# Altium schematic sheet Schematic_ChessBot V1.schdoc
size 296 x 195 mm
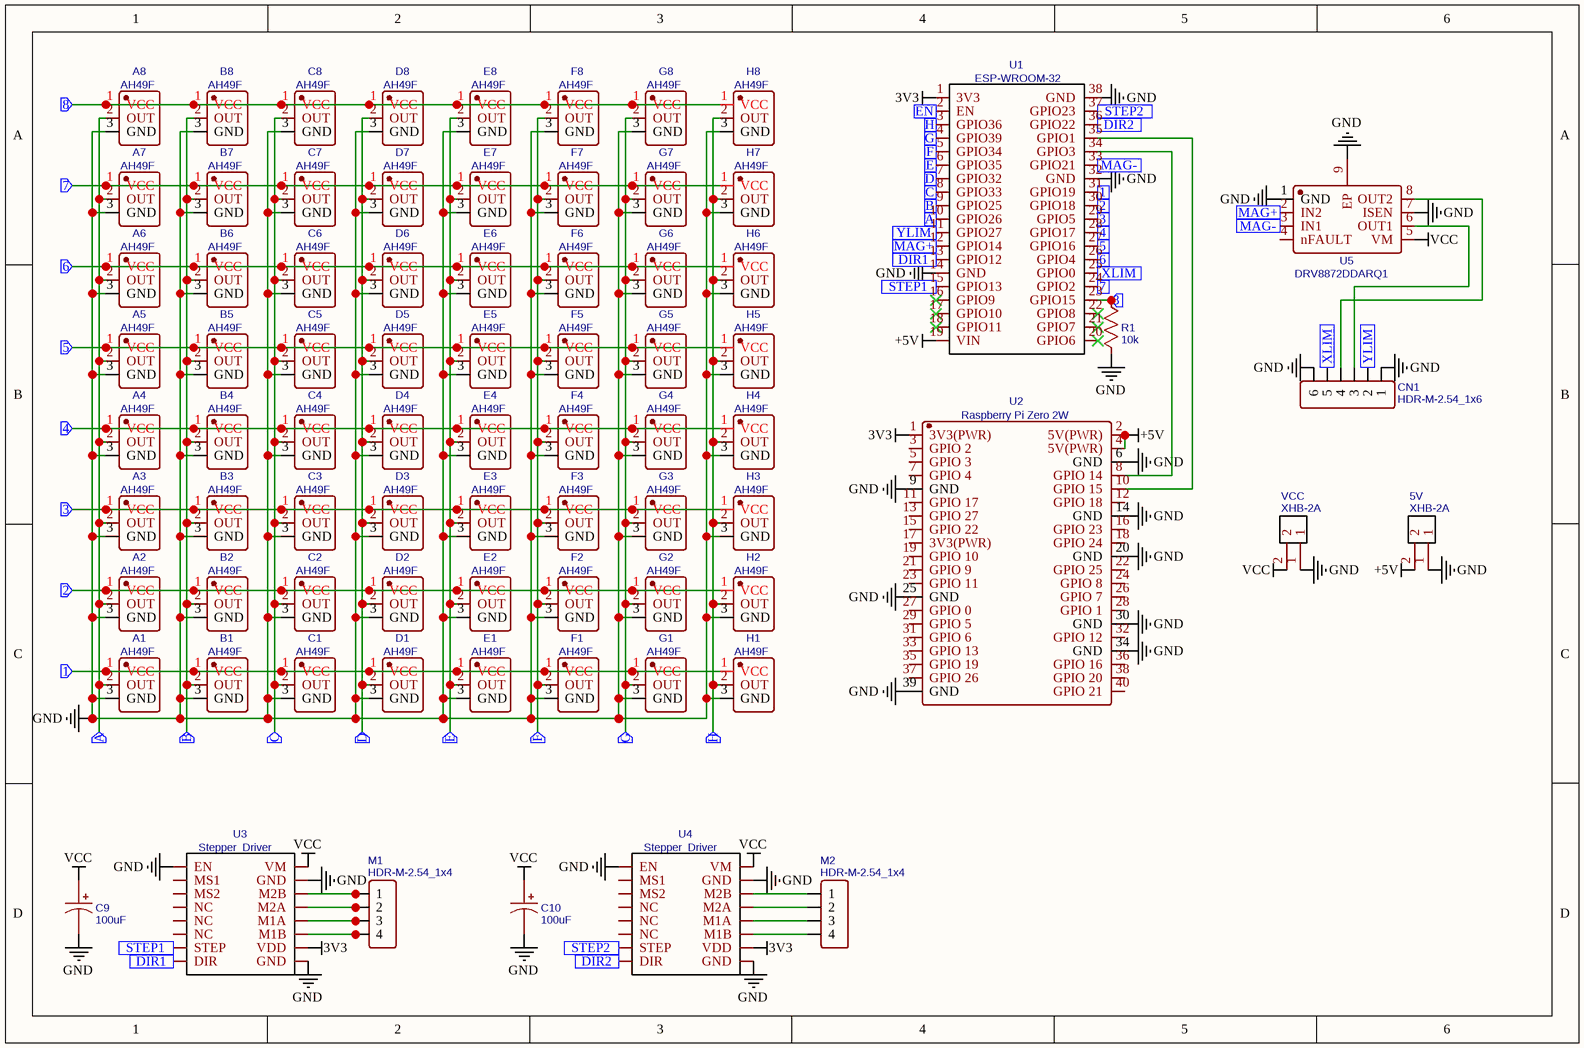
[diagram p0: Schematic_ChessBot V1.schdoc]

## Parts
5V  XHB-2A  [CONN-TH_XHB-2A]
A1  AH49F  [SC-59-3_L2.9-W1.6-P0.95-LS2.9-BR]
A2  AH49F  [SC-59-3_L2.9-W1.6-P0.95-LS2.9-BR]
A3  AH49F  [SC-59-3_L2.9-W1.6-P0.95-LS2.9-BR]
A4  AH49F  [SC-59-3_L2.9-W1.6-P0.95-LS2.9-BR]
A5  AH49F  [SC-59-3_L2.9-W1.6-P0.95-LS2.9-BR]
A6  AH49F  [SC-59-3_L2.9-W1.6-P0.95-LS2.9-BR]
A7  AH49F  [SC-59-3_L2.9-W1.6-P0.95-LS2.9-BR]
A8  AH49F  [SC-59-3_L2.9-W1.6-P0.95-LS2.9-BR]
B1  AH49F  [SC-59-3_L2.9-W1.6-P0.95-LS2.9-BR]
B2  AH49F  [SC-59-3_L2.9-W1.6-P0.95-LS2.9-BR]
B3  AH49F  [SC-59-3_L2.9-W1.6-P0.95-LS2.9-BR]
B4  AH49F  [SC-59-3_L2.9-W1.6-P0.95-LS2.9-BR]
B5  AH49F  [SC-59-3_L2.9-W1.6-P0.95-LS2.9-BR]
B6  AH49F  [SC-59-3_L2.9-W1.6-P0.95-LS2.9-BR]
B7  AH49F  [SC-59-3_L2.9-W1.6-P0.95-LS2.9-BR]
B8  AH49F  [SC-59-3_L2.9-W1.6-P0.95-LS2.9-BR]
C1  AH49F  [SC-59-3_L2.9-W1.6-P0.95-LS2.9-BR]
C2  AH49F  [SC-59-3_L2.9-W1.6-P0.95-LS2.9-BR]
C3  AH49F  [SC-59-3_L2.9-W1.6-P0.95-LS2.9-BR]
C4  AH49F  [SC-59-3_L2.9-W1.6-P0.95-LS2.9-BR]
C5  AH49F  [SC-59-3_L2.9-W1.6-P0.95-LS2.9-BR]
C6  AH49F  [SC-59-3_L2.9-W1.6-P0.95-LS2.9-BR]
C7  AH49F  [SC-59-3_L2.9-W1.6-P0.95-LS2.9-BR]
C8  AH49F  [SC-59-3_L2.9-W1.6-P0.95-LS2.9-BR]
C9  100uF  [8X12 CAP]
C10  100uF  [8X12 CAP]
CN1  HDR-M-2.54_1x6  [HDR-M-2.54_1X6]
D1  AH49F  [SC-59-3_L2.9-W1.6-P0.95-LS2.9-BR]
D2  AH49F  [SC-59-3_L2.9-W1.6-P0.95-LS2.9-BR]
D3  AH49F  [SC-59-3_L2.9-W1.6-P0.95-LS2.9-BR]
D4  AH49F  [SC-59-3_L2.9-W1.6-P0.95-LS2.9-BR]
D5  AH49F  [SC-59-3_L2.9-W1.6-P0.95-LS2.9-BR]
D6  AH49F  [SC-59-3_L2.9-W1.6-P0.95-LS2.9-BR]
D7  AH49F  [SC-59-3_L2.9-W1.6-P0.95-LS2.9-BR]
D8  AH49F  [SC-59-3_L2.9-W1.6-P0.95-LS2.9-BR]
E1  AH49F  [SC-59-3_L2.9-W1.6-P0.95-LS2.9-BR]
E2  AH49F  [SC-59-3_L2.9-W1.6-P0.95-LS2.9-BR]
E3  AH49F  [SC-59-3_L2.9-W1.6-P0.95-LS2.9-BR]
E4  AH49F  [SC-59-3_L2.9-W1.6-P0.95-LS2.9-BR]
E5  AH49F  [SC-59-3_L2.9-W1.6-P0.95-LS2.9-BR]
E6  AH49F  [SC-59-3_L2.9-W1.6-P0.95-LS2.9-BR]
E7  AH49F  [SC-59-3_L2.9-W1.6-P0.95-LS2.9-BR]
E8  AH49F  [SC-59-3_L2.9-W1.6-P0.95-LS2.9-BR]
F1  AH49F  [SC-59-3_L2.9-W1.6-P0.95-LS2.9-BR]
F2  AH49F  [SC-59-3_L2.9-W1.6-P0.95-LS2.9-BR]
F3  AH49F  [SC-59-3_L2.9-W1.6-P0.95-LS2.9-BR]
F4  AH49F  [SC-59-3_L2.9-W1.6-P0.95-LS2.9-BR]
F5  AH49F  [SC-59-3_L2.9-W1.6-P0.95-LS2.9-BR]
F6  AH49F  [SC-59-3_L2.9-W1.6-P0.95-LS2.9-BR]
F7  AH49F  [SC-59-3_L2.9-W1.6-P0.95-LS2.9-BR]
F8  AH49F  [SC-59-3_L2.9-W1.6-P0.95-LS2.9-BR]
G1  AH49F  [SC-59-3_L2.9-W1.6-P0.95-LS2.9-BR]
G2  AH49F  [SC-59-3_L2.9-W1.6-P0.95-LS2.9-BR]
G3  AH49F  [SC-59-3_L2.9-W1.6-P0.95-LS2.9-BR]
G4  AH49F  [SC-59-3_L2.9-W1.6-P0.95-LS2.9-BR]
G5  AH49F  [SC-59-3_L2.9-W1.6-P0.95-LS2.9-BR]
G6  AH49F  [SC-59-3_L2.9-W1.6-P0.95-LS2.9-BR]
G7  AH49F  [SC-59-3_L2.9-W1.6-P0.95-LS2.9-BR]
G8  AH49F  [SC-59-3_L2.9-W1.6-P0.95-LS2.9-BR]
H1  AH49F  [SC-59-3_L2.9-W1.6-P0.95-LS2.9-BR]
H2  AH49F  [SC-59-3_L2.9-W1.6-P0.95-LS2.9-BR]
H3  AH49F  [SC-59-3_L2.9-W1.6-P0.95-LS2.9-BR]
H4  AH49F  [SC-59-3_L2.9-W1.6-P0.95-LS2.9-BR]
H5  AH49F  [SC-59-3_L2.9-W1.6-P0.95-LS2.9-BR]
H6  AH49F  [SC-59-3_L2.9-W1.6-P0.95-LS2.9-BR]
H7  AH49F  [SC-59-3_L2.9-W1.6-P0.95-LS2.9-BR]
H8  AH49F  [SC-59-3_L2.9-W1.6-P0.95-LS2.9-BR]
M1  HDR-M-2.54_1x4  [HDR-M-2.54_1X4]
M2  HDR-M-2.54_1x4  [HDR-M-2.54_1X4]
R1  10k  [1/4W RESISTOR]
U1  ESP-WROOM-32  [ESP32]
U2  Raspberry Pi Zero 2W  [PI ZERO]
U3  Stepper_Driver  [STEPPER_DRIVER]
U4  Stepper_Driver  [STEPPER_DRIVER]
U5  DRV8872DDARQ1  [SO-8_L4.9-W3.9-P1.27-LS6.0-BL-EP5.1]
VCC  XHB-2A  [CONN-TH_XHB-2A]

## Ports
1 (in), 2 (in), 3 (in), 4 (in), 5 (in), 6 (in), 7 (in), 8 (in), A (in), B (in), C (in), D (in), DIR1 (in), DIR2 (in), E (in), EN (in), F (in), G (in), H (in), MAG+ (in), MAG- (in), STEP1 (in), STEP2 (in), XLIM (in), YLIM (in)

## Nets
3V3: U1.1(3V3) U2.1(3V3(PWR)) U3.15(VDD) U4.15(VDD)
+5V: 5V.2 U1.19(VIN) U2.2(5V(PWR)) U2.4(5V(PWR))
GND: 5V.1 A1.3(GND) A2.3(GND) A3.3(GND) A4.3(GND) A5.3(GND) A6.3(GND) A7.3(GND) A8.3(GND) B1.3(GND) B2.3(GND) B3.3(GND) B4.3(GND) B5.3(GND) B6.3(GND) B7.3(GND) B8.3(GND) C1.3(GND) C2.3(GND) C3.3(GND) C4.3(GND) C5.3(GND) C6.3(GND) C7.3(GND) C8.3(GND) C9.2 C10.2 CN1.1 CN1.6 D1.3(GND) D2.3(GND) D3.3(GND) D4.3(GND) D5.3(GND) D6.3(GND) D7.3(GND) D8.3(GND) E1.3(GND) E2.3(GND) E3.3(GND) E4.3(GND) E5.3(GND) E6.3(GND) E7.3(GND) E8.3(GND) F1.3(GND) F2.3(GND) F3.3(GND) F4.3(GND) F5.3(GND) F6.3(GND) F7.3(GND) F8.3(GND) G1.3(GND) G2.3(GND) G3.3(GND) G4.3(GND) G5.3(GND) G6.3(GND) G7.3(GND) G8.3(GND) H1.3(GND) H2.3(GND) H3.3(GND) H4.3(GND) H5.3(GND) H6.3(GND) H7.3(GND) H8.3(GND) R1.1 U1.14(GND) U1.32(GND) U1.38(GND) U2.6(GND) U2.9(GND) U2.14(GND) U2.20(GND) U2.25(GND) U2.30(GND) U2.34(GND) U2.39(GND) U3.1(EN) U3.10(GND) U3.16(GND) U4.1(EN) U4.10(GND) U4.16(GND) U5.1(GND) U5.7(ISEN) U5.9(EP) VCC.1
VCC: C9.1 C10.1 U3.9(VM) U4.9(VM) U5.5(VM) VCC.2
1: A1.1(VCC) B1.1(VCC) C1.1(VCC) D1.1(VCC) E1.1(VCC) F1.1(VCC) G1.1(VCC) H1.1(VCC) U1.31(GPIO19) ; port 1
2: A2.1(VCC) B2.1(VCC) C2.1(VCC) D2.1(VCC) E2.1(VCC) F2.1(VCC) G2.1(VCC) H2.1(VCC) U1.30(GPIO18) ; port 2
3: A3.1(VCC) B3.1(VCC) C3.1(VCC) D3.1(VCC) E3.1(VCC) F3.1(VCC) G3.1(VCC) H3.1(VCC) U1.29(GPIO5) ; port 3
4: A4.1(VCC) B4.1(VCC) C4.1(VCC) D4.1(VCC) E4.1(VCC) F4.1(VCC) G4.1(VCC) H4.1(VCC) U1.28(GPIO17) ; port 4
5: A5.1(VCC) B5.1(VCC) C5.1(VCC) D5.1(VCC) E5.1(VCC) F5.1(VCC) G5.1(VCC) H5.1(VCC) U1.27(GPIO16) ; port 5
6: A6.1(VCC) B6.1(VCC) C6.1(VCC) D6.1(VCC) E6.1(VCC) F6.1(VCC) G6.1(VCC) H6.1(VCC) U1.26(GPIO4) ; port 6
7: A7.1(VCC) B7.1(VCC) C7.1(VCC) D7.1(VCC) E7.1(VCC) F7.1(VCC) G7.1(VCC) H7.1(VCC) U1.24(GPIO2) ; port 7
8: A8.1(VCC) B8.1(VCC) C8.1(VCC) D8.1(VCC) E8.1(VCC) F8.1(VCC) G8.1(VCC) H8.1(VCC) R1.2 U1.23(GPIO15) ; port 8
A: A1.2(OUT) A2.2(OUT) A3.2(OUT) A4.2(OUT) A5.2(OUT) A6.2(OUT) A7.2(OUT) A8.2(OUT) U1.10(GPIO26) ; port A
B: B1.2(OUT) B2.2(OUT) B3.2(OUT) B4.2(OUT) B5.2(OUT) B6.2(OUT) B7.2(OUT) B8.2(OUT) U1.9(GPIO25) ; port B
C: C1.2(OUT) C2.2(OUT) C3.2(OUT) C4.2(OUT) C5.2(OUT) C6.2(OUT) C7.2(OUT) C8.2(OUT) U1.8(GPIO33) ; port C
D: D1.2(OUT) D2.2(OUT) D3.2(OUT) D4.2(OUT) D5.2(OUT) D6.2(OUT) D7.2(OUT) D8.2(OUT) U1.7(GPIO32) ; port D
DIR1: U1.13(GPIO12) U3.8(DIR) ; port DIR1
DIR2: U1.36(GPIO22) U4.8(DIR) ; port DIR2
E: E1.2(OUT) E2.2(OUT) E3.2(OUT) E4.2(OUT) E5.2(OUT) E6.2(OUT) E7.2(OUT) E8.2(OUT) U1.6(GPIO35) ; port E
EN: U1.2(EN) ; port EN
F: F1.2(OUT) F2.2(OUT) F3.2(OUT) F4.2(OUT) F5.2(OUT) F6.2(OUT) F7.2(OUT) F8.2(OUT) U1.5(GPIO34) ; port F
G: G1.2(OUT) G2.2(OUT) G3.2(OUT) G4.2(OUT) G5.2(OUT) G6.2(OUT) G7.2(OUT) G8.2(OUT) U1.4(GPIO39) ; port G
H: H1.2(OUT) H2.2(OUT) H3.2(OUT) H4.2(OUT) H5.2(OUT) H6.2(OUT) H7.2(OUT) H8.2(OUT) U1.3(GPIO36) ; port H
MAG+: U1.12(GPIO14) U5.2(IN2) ; port MAG+
MAG-: U1.33(GPIO21) U5.3(IN1) ; port MAG-
STEP1: U1.15(GPIO13) U3.7(STEP) ; port STEP1
STEP2: U1.37(GPIO23) U4.7(STEP) ; port STEP2
XLIM: CN1.5 U1.25(GPIO0) ; port XLIM
YLIM: CN1.2 U1.11(GPIO27) ; port YLIM
NetCN1_3: CN1.3 U5.6(OUT1)
NetCN1_4: CN1.4 U5.8(OUT2)
NetM1_1: M1.1 U3.11(M2B)
NetM1_2: M1.2 U3.12(M2A)
NetM1_3: M1.3 U3.13(M1A)
NetM1_4: M1.4 U3.14(M1B)
NetM2_1: M2.1 U4.11(M2B)
NetM2_2: M2.2 U4.12(M2A)
NetM2_3: M2.3 U4.13(M1A)
NetM2_4: M2.4 U4.14(M1B)
NetU1_34: U1.34(GPIO3) U2.8(GPIO_14)
NetU1_35: U1.35(GPIO1) U2.10(GPIO_15)

Not connected (* = marked no-connect by the designer): U1 16(GPIO9)* 17(GPIO10)* 18(GPIO11)* 20(GPIO6)* 21(GPIO7)* 22(GPIO8)*; U2 3(GPIO_2) 5(GPIO_3) 7(GPIO_4) 11(GPIO_17) 12(GPIO_18) 13(GPIO_27) 15(GPIO_22) 16(GPIO_23) 17(3V3(PWR)) 18(GPIO_24) 19(GPIO_10) 21(GPIO_9) 22(GPIO_25) 23(GPIO_11) 24(GPIO_8) 26(GPIO_7) 27(GPIO_0) 28(GPIO_1) 29(GPIO_5) 31(GPIO_6) 32(GPIO_12) 33(GPIO_13) 35(GPIO_19) 36(GPIO_16) 37(GPIO_26) 38(GPIO_20) 40(GPIO_21); U3 2(MS1) 3(MS2) 4(NC) 5(NC) 6(NC); U4 2(MS1) 3(MS2) 4(NC) 5(NC) 6(NC); U5 4(nFAULT)

## Library data of the parts
5V VCC = XHB-2A: Manufacturer: BOOMELE(博穆精密); Supplier: LCSC; Manufacturer Part: XHB-2A; Supplier Part: C57981; JLCPCB Part Class: Extended Part; spicePre: C; spiceSymbolName: XHB-2A Connector
A1-A8 B1-B8 C1-C8 D1-D8 E1-E8 F1-F8 G1-G8 H1-H8 = AH49F: Manufacturer: DIODES(美台); Manufacturer Part: AH49FNTR-G1; Contributor: LCSC; Supplier: LCSC; Supplier Part: C176936; JLCPCB Part Class: Extended Part; spicePre: U; spiceSymbolName: AH49FNTR-G1
C9 C10 = 100uF: nameAlias: Value(F); Contributor: LCEDA_Lib; spicePre: C; spiceSymbolName: CE_TH_D4.0×F1.5_US
CN1 = HDR-M-2.54_1x6: Contributor: LCEDA_Lib; Supplier Part: C190819; Supplier: LCSC; spicePre: J; spiceSymbolName: HDR-M-2.54_1x6
M1 M2 = HDR-M-2.54_1x4: Contributor: LCEDA_Lib; Supplier Part: C124378; Supplier: LCSC; spicePre: J; spiceSymbolName: HDR-M-2.54_1x4
R1 = 10k: nameAlias: Value(Ω); Contributor: LCEDA_Lib; spicePre: R; spiceSymbolName: R_AXIAL-0.3_US
U1 = ESP-WROOM-32: Contributor: joshuastanleyrobotics; spicePre: U; spiceSymbolName: ESP32
U2 = Raspberry Pi Zero 2W: Contributor: ragg2007; Manufacturer Part: Pi Zero; spicePre: U; spiceSymbolName: Raspberry Pi Zero 2W
U3 U4 = Stepper_Driver: Contributor: joshuastanleyrobotics; spicePre: U; spiceSymbolName: Stepper_Driver
U5 = DRV8872DDARQ1: Manufacturer: TI(德州仪器); Contributor: LCSC; Supplier: LCSC; Supplier Part: C524788; Manufacturer Part: DRV8872DDARQ1; JLCPCB Part Class: Extended Part; spicePre: U; spiceSymbolName: DRV8872DDARQ1